# EAGLE design power_supply_board (EAGLE 7.2.0)
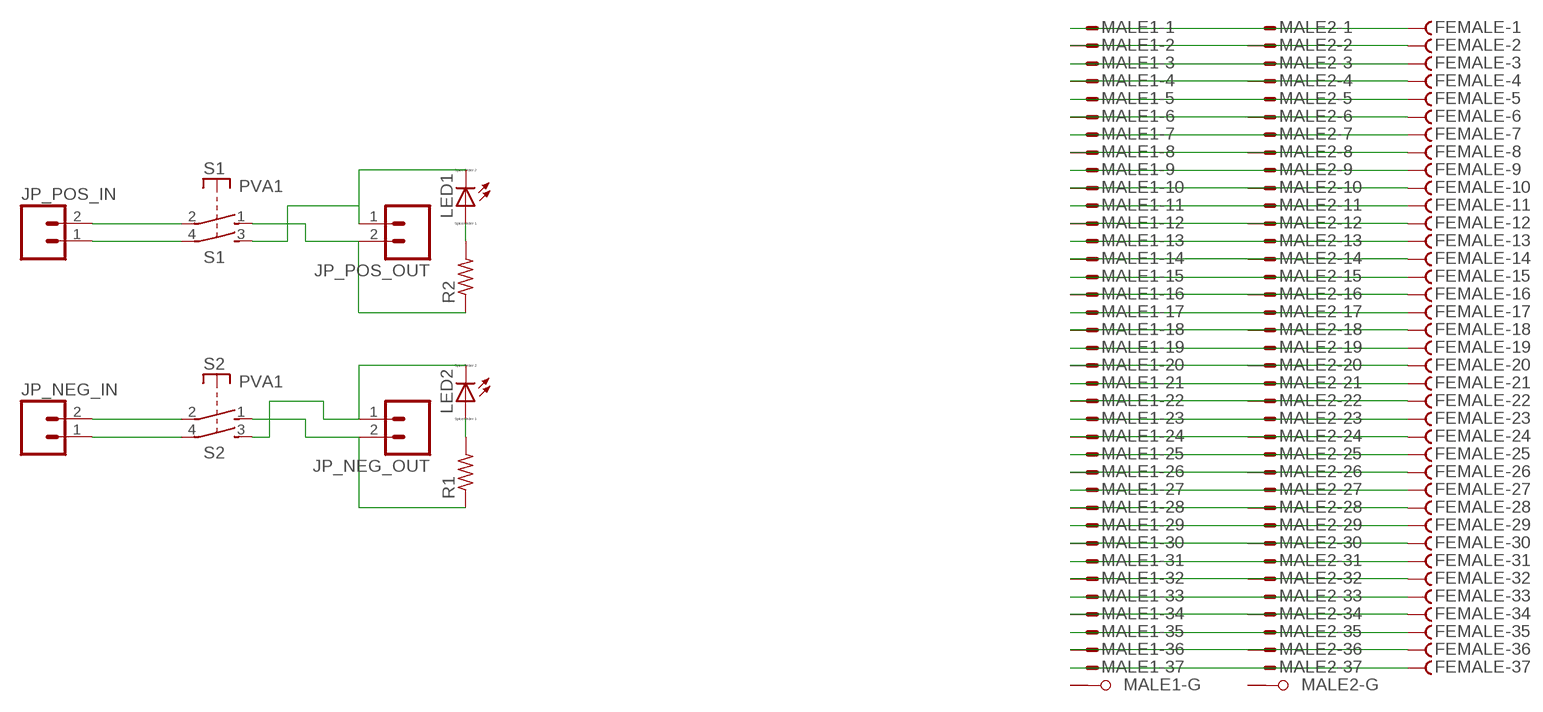
[diagram p0: schematic, sheet 1]

## Parts
FEMALE  F37HPS  [F37HP]
JP_NEG_IN  M02-JST-2MM-SMT  [JST-2-SMD]
JP_NEG_OUT  M02-JST-2MM-SMT  [JST-2-SMD]
JP_POS_IN  M02-JST-2MM-SMT  [JST-2-SMD]
JP_POS_OUT  M02-JST-2MM-SMT  [JST-2-SMD]
LED1  LED_ELED0402  [C0402]
LED2  LED_ELED0402  [C0402]
MALE1  M37HPS  [M37HP]
MALE2  M37HPS  [M37HP]
R1  R-US_R0805  [R0805]
R2  R-US_R0805  [R0805]
S1  PVA1  [PVA1F]
S2  PVA1  [PVA1F]

## Nets
N$1: LED1.A R2.2
N$2: LED2.A R1.2
N$3: JP_POS_IN.2 S1.2(1:P)
N$4: JP_POS_IN.1 S1.4(2:P)
N$5: JP_NEG_IN.2 S2.2(1:P)
N$6: JP_NEG_IN.1 S2.4(2:P)
N$7: JP_POS_OUT.2 R2.1 S1.1(1:S)
N$8: JP_POS_OUT.1 LED1.C S1.3(2:S)
N$9: JP_NEG_OUT.2 R1.1 S2.1(1:S)
N$10: JP_NEG_OUT.1 LED2.C S2.3(2:S)
N$11: FEMALE.1 MALE1.1(-1:M) MALE2.1(-1:M)
N$12: FEMALE.2 MALE1.2(-2:M) MALE2.2(-2:M)
N$13: FEMALE.3 MALE1.3(-3:M) MALE2.3(-3:M)
N$14: FEMALE.4 MALE1.4(-4:M) MALE2.4(-4:M)
N$15: FEMALE.5 MALE1.5(-5:M) MALE2.5(-5:M)
N$16: FEMALE.6 MALE1.6(-6:M) MALE2.6(-6:M)
N$17: FEMALE.7 MALE1.7(-7:M) MALE2.7(-7:M)
N$18: FEMALE.8 MALE1.8(-8:M) MALE2.8(-8:M)
N$19: FEMALE.9 MALE1.9(-9:M) MALE2.9(-9:M)
N$20: FEMALE.10 MALE1.10(-10:M) MALE2.10(-10:M)
N$21: FEMALE.11 MALE1.11(-11:M) MALE2.11(-11:M)
N$22: FEMALE.12 MALE1.12(-12:M) MALE2.12(-12:M)
N$23: FEMALE.13 MALE1.13(-13:M) MALE2.13(-13:M)
N$24: FEMALE.14 MALE1.14(-14:M) MALE2.14(-14:M)
N$25: FEMALE.15 MALE1.15(-15:M) MALE2.15(-15:M)
N$26: FEMALE.16 MALE1.16(-16:M) MALE2.16(-16:M)
N$27: FEMALE.17 MALE1.17(-17:M) MALE2.17(-17:M)
N$28: FEMALE.18 MALE1.18(-18:M) MALE2.18(-18:M)
N$29: FEMALE.19 MALE1.19(-19:M) MALE2.19(-19:M)
N$30: FEMALE.20 MALE1.20(-20:M) MALE2.20(-20:M)
N$31: FEMALE.21 MALE1.21(-21:M) MALE2.21(-21:M)
N$32: FEMALE.22 MALE1.22(-22:M) MALE2.22(-22:M)
N$33: FEMALE.23 MALE1.23(-23:M) MALE2.23(-23:M)
N$34: FEMALE.24 MALE1.24(-24:M) MALE2.24(-24:M)
N$35: FEMALE.25 MALE1.25(-25:M) MALE2.25(-25:M)
N$36: FEMALE.26 MALE1.26(-26:M) MALE2.26(-26:M)
N$37: FEMALE.27 MALE1.27(-27:M) MALE2.27(-27:M)
N$38: FEMALE.28 MALE1.28(-28:M) MALE2.28(-28:M)
N$39: FEMALE.29 MALE1.29(-29:M) MALE2.29(-29:M)
N$40: FEMALE.30 MALE1.30(-30:M) MALE2.30(-30:M)
N$41: FEMALE.31 MALE1.31(-31:M) MALE2.31(-31:M)
N$42: FEMALE.32 MALE1.32(-32:M) MALE2.32(-32:M)
N$43: FEMALE.33 MALE1.33(-33:M) MALE2.33(-33:M)
N$44: FEMALE.34 MALE1.34(-34:M) MALE2.34(-34:M)
N$45: FEMALE.35 MALE1.35(-35:M) MALE2.35(-35:M)
N$46: FEMALE.36 MALE1.36(-36:M) MALE2.36(-36:M)
N$47: FEMALE.37 MALE1.37(-37:M) MALE2.37(-37:M)
Unconnected: MALE1.G1(-G:G1) MALE1.G2(-G:G2) MALE2.G1(-G:G1) MALE2.G2(-G:G2)

## Library data of the parts
FEMALE = con-subd:F37?S: SUB-D; OC_FARNELL: unknown; OC_NEWARK: unknown
JP_NEG_IN JP_NEG_OUT JP_POS_IN JP_POS_OUT = SwitchBoard:M02: Header 2 Standard 2-pin 0.1" header. Use with straight break away headers (SKU : PRT-00116), right angle break away headers (PRT-00553), swiss pins (PRT-00743), machine pins (PRT-00117), and female headers (PRT-00115). Molex polarized connector foot print use with SKU : PRT-08233 with associated crimp pins and housings.
LED1 LED2 = eagle-ltspice:LED_E: LED Source: http://www.osram.convergy.de Source: www.luxeon.com Source: www.kingbright.com
MALE1 MALE2 = con-subd:M37HPS: SUB-D; OC_FARNELL: unknown; OC_NEWARK: unknown
R1 R2 = resistor:R-US_: RESISTOR, American symbol
S1 S2 = switch-misc:PVA1: ITT SWITCH

## Board
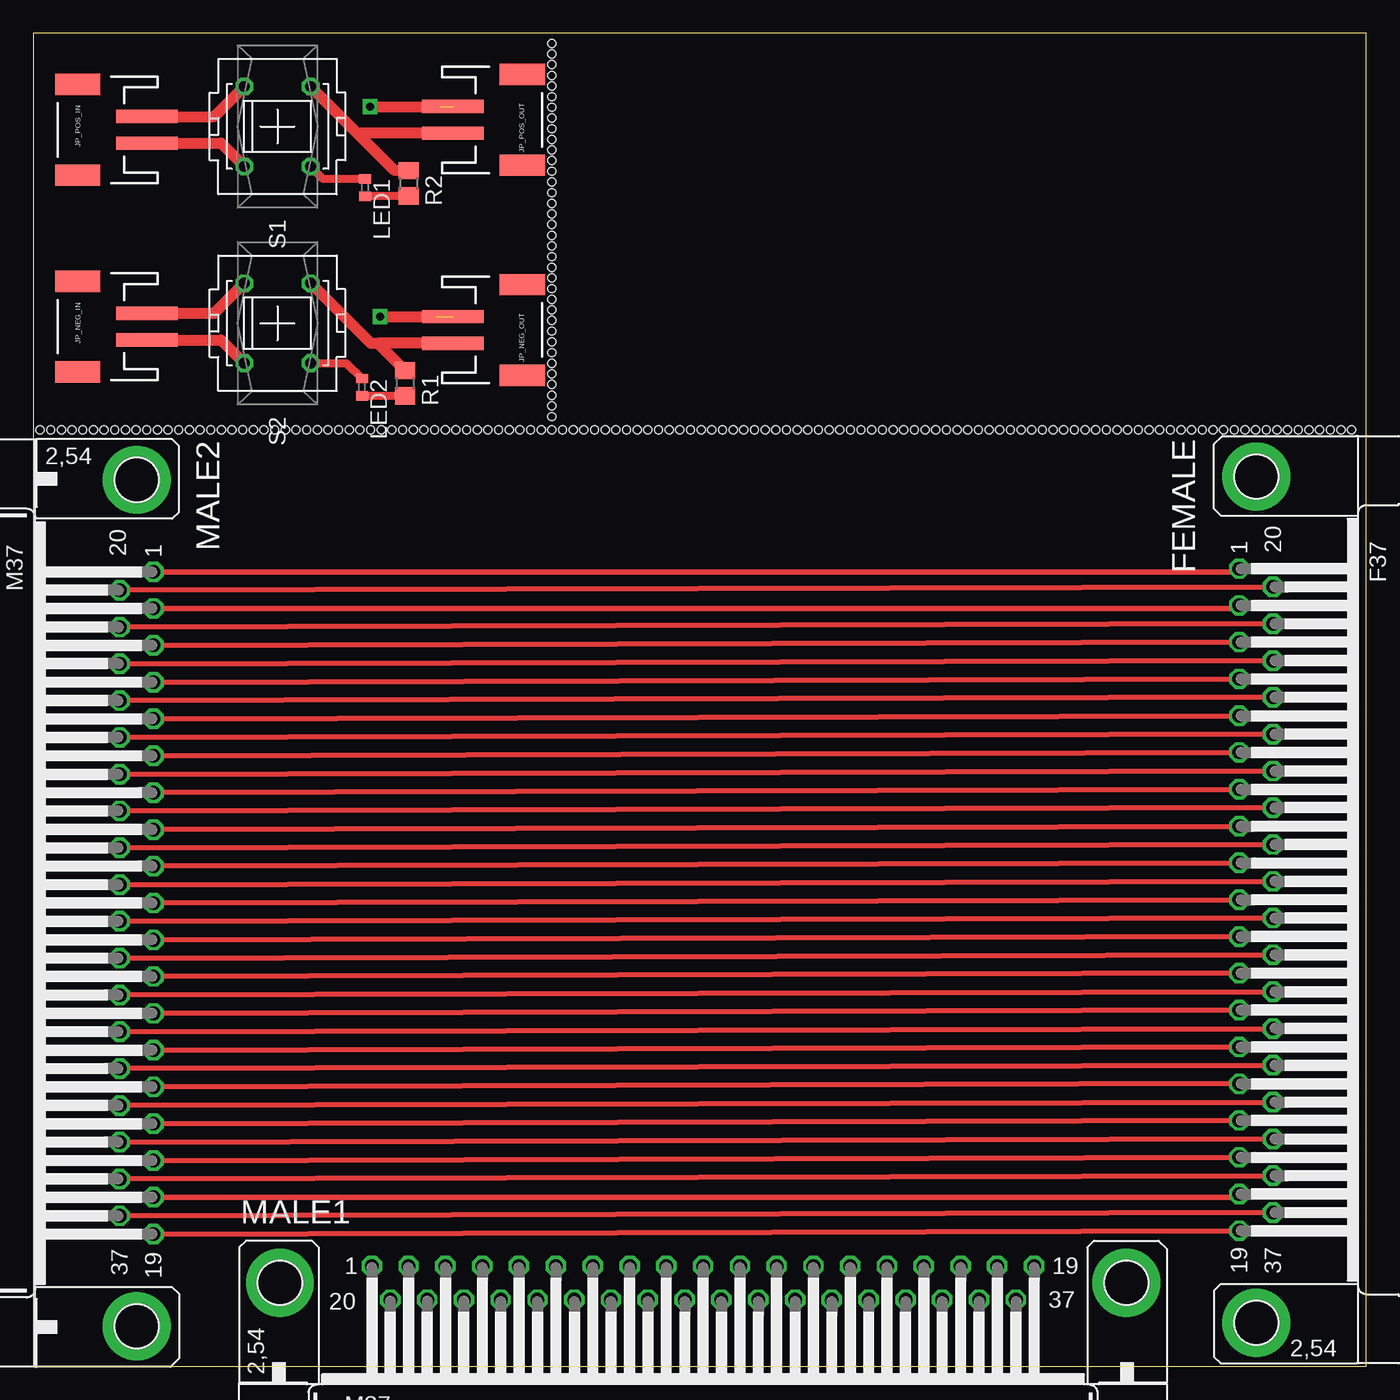
[diagram p1: board, top side]
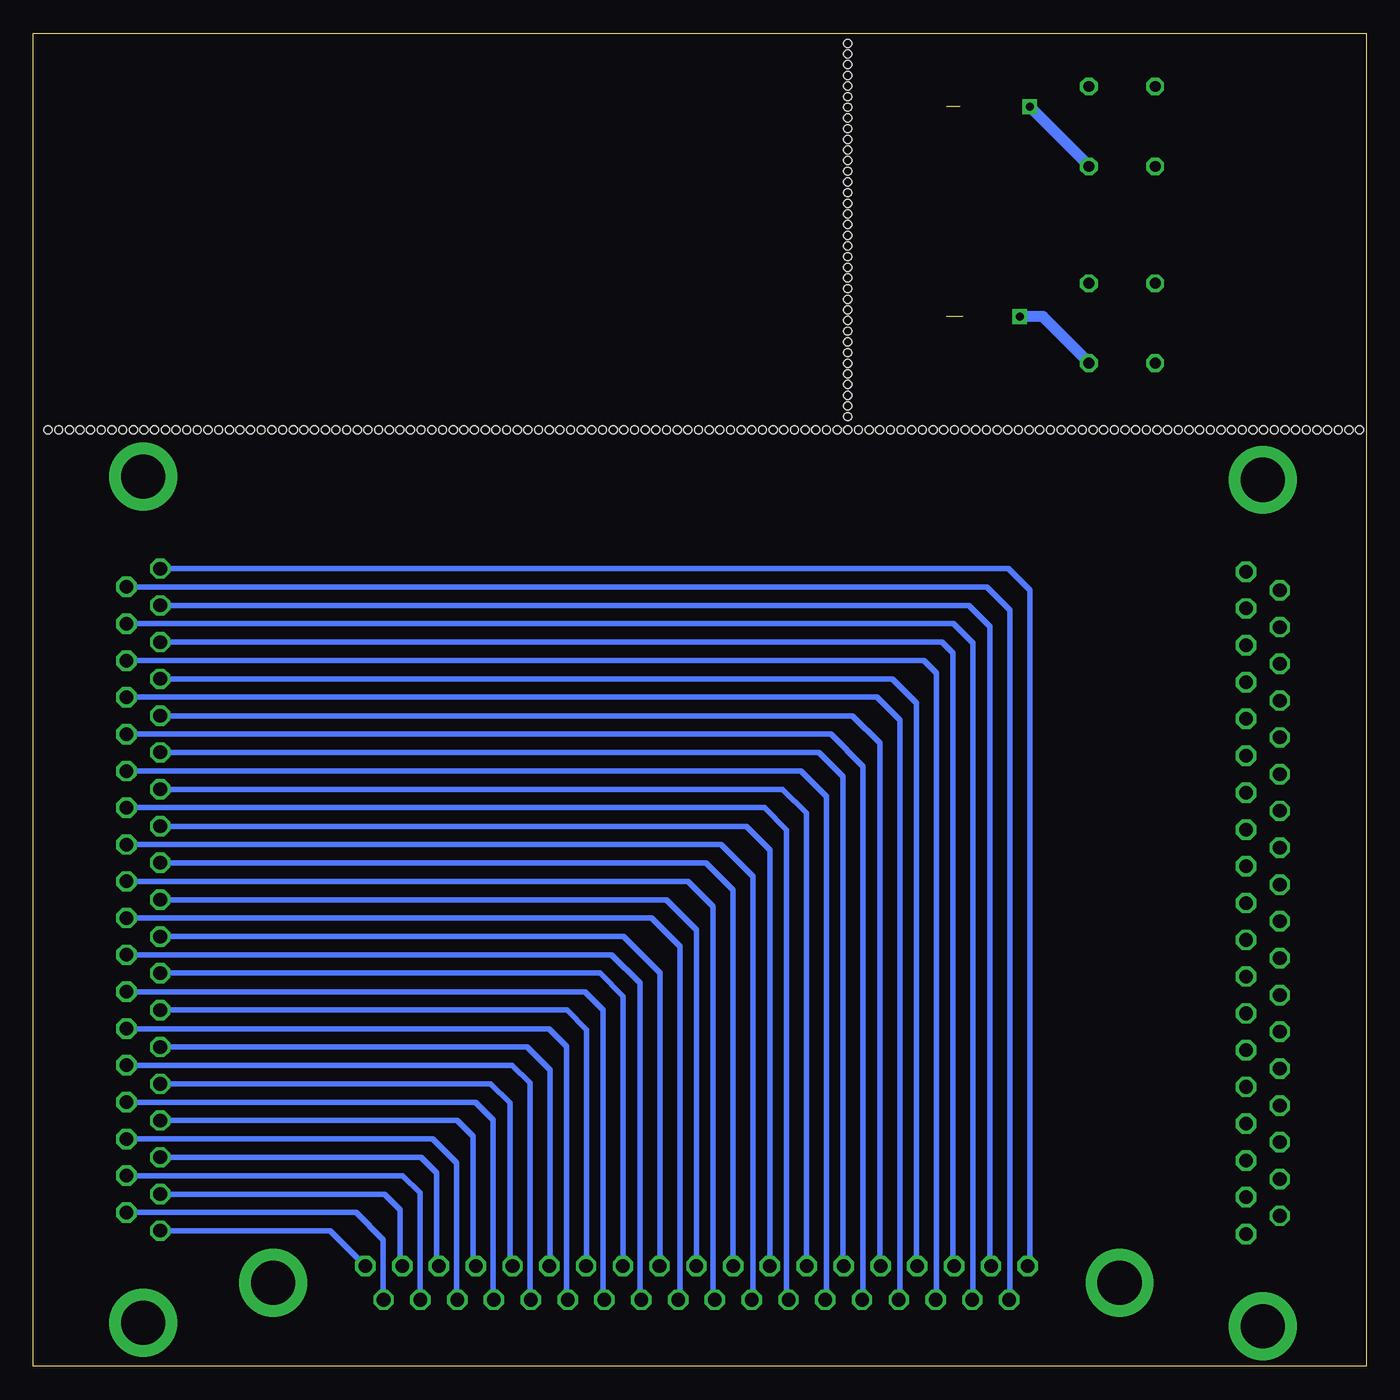
[diagram p2: board, bottom side, seen from below]

Size 100 x 100 mm. Coordinates in mm from the lower left corner, seen from the top.
Outline: 0,0 100,0 100,100 0,100 0,0
Copper layers (1*16): Top 0.035mm / dielectric 1.5mm / Bottom 0.035mm
Design rules "pcbtrain": minimum track width 0.2mm, minimum drill 0.4mm, track to track 0.2mm, track to pad 0.2mm, pad to pad 0.2mm, via to via 0.2mm, smd to smd 0mil, copper to edge 10mil, drill to drill 0.2mm, minimum pad ring 10mil, minimum via ring 10mil, stop-mask expansion 0.125mm, vias tented up to drill 0mil, thermal gap 10mil
Holes 0.6 mm at 0.5,70.25 1.3,70.25 2.1,70.25 2.9,70.25 3.7,70.25 4.5,70.25 5.3,70.25 6.1,70.25 6.9,70.25 7.7,70.25 8.5,70.25 9.3,70.25 10.1,70.25 10.9,70.25 11.7,70.25 12.5,70.25 13.3,70.25 14.1,70.25 14.9,70.25 15.7,70.25 16.5,70.25 17.3,70.25 18.1,70.25 18.9,70.25 19.7,70.25 20.5,70.25 21.3,70.25 22.1,70.25 22.9,70.25 23.7,70.25 24.5,70.25 25.3,70.25 26.1,70.25 26.9,70.25 27.7,70.25 28.5,70.25 29.3,70.25 30.1,70.25 30.9,70.25 31.7,70.25 32.5,70.25 33.3,70.25 34.1,70.25 34.9,70.25 35.7,70.25 36.5,70.25 37.3,70.25 38.1,70.25 38.9,70.25 39.7,70.25 40.5,70.25 41.3,70.25 42.1,70.25 42.9,70.25 43.7,70.25 44.5,70.25 45.3,70.25 46.1,70.25 46.9,70.25 47.7,70.25 48.5,70.25 49.3,70.25 50.1,70.25 50.9,70.25 51.7,70.25 52.5,70.25 53.3,70.25 54.1,70.25 54.9,70.25 55.7,70.25 56.5,70.25 57.3,70.25 58.1,70.25 58.9,70.25 59.7,70.25 60.5,70.25 61.3,70.25 62.1,70.25 62.9,70.25 63.7,70.25 64.5,70.25 65.3,70.25 66.1,70.25 66.9,70.25 67.7,70.25 68.5,70.25 69.3,70.25 70.1,70.25 70.9,70.25 71.7,70.25 72.5,70.25 73.3,70.25 74.1,70.25 74.9,70.25 75.7,70.25 76.5,70.25 77.3,70.25 78.1,70.25 78.9,70.25 79.7,70.25 80.5,70.25 81.3,70.25 82.1,70.25 82.9,70.25 83.7,70.25 84.5,70.25 85.3,70.25 86.1,70.25 86.9,70.25 87.7,70.25 88.5,70.25 89.3,70.25 90.1,70.25 90.9,70.25 91.7,70.25 92.5,70.25 93.3,70.25 94.1,70.25 94.9,70.25 95.7,70.25 96.5,70.25 97.3,70.25 98.1,70.25 98.9,70.25 38.9,71.25 38.9,72.05 38.9,72.85 38.9,73.65 38.9,74.45 38.9,75.25 38.9,76.05 38.9,76.85 38.9,77.65 38.9,78.45 38.9,79.25 38.9,80.05 38.9,80.85 38.9,81.65 38.9,82.45 38.9,83.25 38.9,84.05 38.9,84.85 38.9,85.65 38.9,86.45 38.9,87.25 38.9,88.05 38.9,88.85 38.9,89.65 38.9,90.45 38.9,91.25 38.9,92.05 38.9,92.85 38.9,93.65 38.9,94.45 38.9,95.25 38.9,96.05 38.9,96.85 38.9,97.65 38.9,98.45 38.9,99.25

### Footprints (pad centres in the part's own frame; a part is rotated, then mirrored left to right if it is on the bottom)
F37HP = drill 1.016 octagon: 1 -24.841,-1.27; 2 -22.073,-1.27; 3 -19.329,-1.27; 4 -16.561,-1.27; 5 -13.792,-1.27; 6 -11.049,-1.27; 7 -8.28,-1.27; 8 -5.512,-1.27; 9 -2.769,-1.27; 10 0,-1.27; 11 2.769,-1.27; 12 5.512,-1.27; 13 8.28,-1.27; 14 11.049,-1.27; 15 13.818,-1.27; 16 16.561,-1.27; 17 19.329,-1.27; 18 22.098,-1.27; 19 24.841,-1.27; 20 -23.47,1.27; 21 -20.701,1.27; 22 -17.932,1.27; 23 -15.189,1.27; 24 -12.421,1.27; 25 -9.652,1.27; 26 -6.909,1.27; 27 -4.14,1.27; 28 -1.372,1.27; 29 1.372,1.27; 30 4.14,1.27; 31 6.909,1.27; 32 9.677,1.27; 33 12.421,1.27; 34 15.189,1.27; 35 17.958,1.27; 36 20.701,1.27; 37 23.47,1.27 | drill 3.302 pad 5.08: G1 -31.75,0; G2 31.75,0
JST-2-SMD = smd 1 x 4.6: 1 -1,-3.7; 2 1,-3.7 | smd 1.6 x 3.4: NC1 -3.4,1.5; NC2 3.4,1.5
C0402 = smd 0.7 x 0.9: A 0.65,0; C -0.65,0
M37HP = drill 1.016 octagon: 1 -24.841,1.27; 2 -22.098,1.27; 3 -19.329,1.27; 4 -16.561,1.27; 5 -13.818,1.27; 6 -11.049,1.27; 7 -8.28,1.27; 8 -5.512,1.27; 9 -2.769,1.27; 10 0,1.27; 11 2.769,1.27; 12 5.512,1.27; 13 8.28,1.27; 14 11.049,1.27; 15 13.792,1.27; 16 16.561,1.27; 17 19.329,1.27; 18 22.073,1.27; 19 24.841,1.27; 20 -23.47,-1.27; 21 -20.701,-1.27; 22 -17.958,-1.27; 23 -15.189,-1.27; 24 -12.421,-1.27; 25 -9.652,-1.27; 26 -6.909,-1.27; 27 -4.14,-1.27; 28 -1.372,-1.27; 29 1.372,-1.27; 30 4.14,-1.27; 31 6.909,-1.27; 32 9.652,-1.27; 33 12.421,-1.27; 34 15.189,-1.27; 35 17.932,-1.27; 36 20.701,-1.27; 37 23.47,-1.27 | drill 3.302 pad 5.08: G1 -31.75,0; G2 31.75,0
R0805 = smd 1.3 x 1.5: 1 -0.95,0; 2 0.95,0
PVA1F = drill 0.813 octagon: 1 -2.997,2.489; 2 -2.997,-2.489; 3 2.997,2.489; 4 2.997,-2.489

### Placement (x,y rotation side)
FEMALE  91.75,35 270 top
JP_NEG_IN  4.83,78 90 top
JP_NEG_OUT  35.18,77.75 270 top
JP_POS_IN  4.83,92.76 90 top
JP_POS_OUT  35.18,93.51 270 top
LED1  24.88,88.42 270 top
LED2  24.65,73.44 270 top
MALE1  50.25,6.25 0 top
MALE2  7.75,34.75 270 top
R1  27.88,73.75 270 top
R2  28.15,88.75 270 top
S1  18.32,93.01 270 top
S2  18.32,78.25 270 top

### Tracks (layer width: path | path; a pad name or v marks a point on that pad's centre or on a via)
N$1
  Top 0.61: R2.2 28.12,87.77 LED1.A
N$2
  Top 0.61: R1.2 LED2.A
N$3
  Top 0.813: JP_POS_IN.2 13.58,93.76 S1.2
N$4
  Top 0.813: JP_POS_IN.1 14.08,91.76 S1.4
N$5
  Top 0.813: JP_NEG_IN.2 13.58,79 S2.2
N$6
  Top 0.813: JP_NEG_IN.1 14.08,77 S2.4
N$7
  Top 0.813: JP_POS_OUT.2 24.31,92.51 | 24.31,92.51 S1.1 | R2.1 27.12,89.7 24.31,92.51
N$8  (via drill 0.6)  (1 unrouted)
  Top 0.61: LED1.C 21.75,89.07 S1.3
  Top 0.813: v25.25,94.5 30.5,94.5
  Bottom 0.813: S1.3 20.81,90.06 v25.25,94.5
N$9
  Top 0.813: JP_NEG_OUT.2 25.83,76.75 | S2.1 25.31,76.75 25.83,76.75 | 25.83,76.75 R1.1
N$10  (via drill 0.6)  (1 unrouted)
  Top 0.61: S2.3 23.49,75.25 LED2.C
  Top 0.813: v26,78.75 30.25,78.75
  Bottom 0.813: S2.3 20.81,75.31 24.25,78.75 v26,78.75
N$11
  Top 0.406: MALE2.1 90.23,59.59 FEMALE.1
  Bottom 0.406: MALE1.1 25.25,7.68 25.25,58.25 26.84,59.84 FEMALE.1
N$12
  Top 0.406: MALE2.2 90.25,56.85 FEMALE.2
  Bottom 0.406: MALE1.2 28.25,7.62 28.25,55.5 29.82,57.07 FEMALE.2
N$13
  Top 0.406: MALE2.3 90.23,54.33 FEMALE.3
  Bottom 0.406: MALE1.3 31,7.6 31,53.5 31.83,54.33 FEMALE.3
N$14
  Top 0.406: FEMALE.4 MALE2.4
  Bottom 0.406: MALE1.4 33.75,7.58 33.75,49.75 35.56,51.56 FEMALE.4
N$15
  Top 0.406: FEMALE.5 9.24,48.54 MALE2.5
  Bottom 0.406: MALE1.5 36.5,7.59 36.5,46.75 38.54,48.79 FEMALE.5
N$16
  Top 0.406: FEMALE.6 9.27,45.8 MALE2.6
  Bottom 0.406: MALE1.6 39.25,7.57 39.25,44.25 41.05,46.05 FEMALE.6
N$17
  Top 0.406: FEMALE.7 MALE2.7
  Bottom 0.406: MALE1.7 42,7.55 42,41.5 43.78,43.28 FEMALE.7
N$18
  Top 0.406: FEMALE.8 MALE2.8
  Bottom 0.406: MALE1.8 44.75,7.53 44.75,38.75 46.51,40.51 FEMALE.8
N$19
  Top 0.406: FEMALE.9 9.27,37.52 MALE2.9
  Bottom 0.406: MALE1.9 47.5,7.54 47.5,35.75 49.52,37.77 FEMALE.9
N$20
  Top 0.406: FEMALE.10 9.27,34.75 MALE2.10
  Bottom 0.406: MALE1.10 50.25,32.75 52.5,35 FEMALE.10
N$21
  Top 0.406: FEMALE.11 9.27,31.98 MALE2.11
  Bottom 0.406: MALE1.11 53,7.54 53,29.5 55.73,32.23 FEMALE.11
N$22
  Top 0.406: MALE2.12 90.23,29.49 FEMALE.12
  Bottom 0.406: MALE1.12 55.75,7.53 55.75,27.75 57.49,29.49 FEMALE.12
N$23
  Top 0.406: MALE2.13 90.23,26.72 FEMALE.13
  Bottom 0.406: MALE1.13 58.5,7.55 58.5,25.25 59.97,26.72 FEMALE.13
N$24
  Top 0.406: MALE2.14 90.23,23.95 FEMALE.14
  Bottom 0.406: MALE1.14 61.25,7.57 61.25,22.25 62.95,23.95 FEMALE.14
N$25
  Top 0.406: MALE2.15 89.96,21.21 90.5,21.25 90.5,20.95 FEMALE.15
  Bottom 0.406: MALE1.15 64.25,7.73 64.25,19.75 65.68,21.18 FEMALE.15
N$26
  Top 0.406: MALE2.16 90.23,18.44 FEMALE.16
  Bottom 0.406: MALE1.16 67,7.71 67,17.25 68.19,18.44 FEMALE.16
N$27
  Top 0.406: MALE2.17 FEMALE.17
  Bottom 0.406: MALE1.17 69.75,7.69 69.75,14.5 70.92,15.67 FEMALE.17
N$28
  Top 0.406: MALE2.18 90.25,12.68 FEMALE.18
  Bottom 0.406: MALE1.18 72.5,7.7 72.5,11.75 73.65,12.9 FEMALE.18
N$29
  Top 0.406: MALE2.19 90.23,10.16 FEMALE.19
  Bottom 0.406: MALE1.19 77.73,10.16 FEMALE.19
N$30
  Top 0.406: FEMALE.20 6.73,58.22 MALE2.20
  Bottom 0.406: MALE1.20 26.75,5.01 26.75,56.75 28.47,58.47 FEMALE.20
N$31
  Top 0.406: FEMALE.21 6.73,55.45 MALE2.21
  Bottom 0.406: MALE1.21 29.5,5.03 29.5,54.25 30.95,55.7 FEMALE.21
N$32
  Top 0.406: FEMALE.22 6.71,52.68 MALE2.22
  Bottom 0.406: MALE1.22 32.25,5.02 32.25,52 33.18,52.93 FEMALE.22
N$33
  Top 0.406: FEMALE.23 6.44,49.94 6,49.75 6.29,49.75 MALE2.23
  Bottom 0.406: MALE1.23 35,5.04 35,48.5 36.69,50.19 FEMALE.23
N$34
  Top 0.406: FEMALE.24 6.73,47.17 MALE2.24
  Bottom 0.406: MALE1.24 37.75,5.06 37.75,45 40.17,47.42 FEMALE.24
N$35
  Top 0.406: FEMALE.25 6.73,44.4 MALE2.25
  Bottom 0.406: MALE1.25 40.5,5.08 40.5,42.75 42.4,44.65 92.5,44.65 FEMALE.25
N$36
  Top 0.406: FEMALE.26 6.73,41.66 MALE2.26
  Bottom 0.406: MALE1.26 43.5,5.14 43.5,40.25 45.16,41.91 FEMALE.26
N$37
  Top 0.406: FEMALE.27 6.73,38.89 MALE2.27
  Bottom 0.406: MALE1.27 46,5.09 46,36.75 48.39,39.14 FEMALE.27
N$38
  Top 0.406: FEMALE.28 6.73,36.12 MALE2.28
  Bottom 0.406: MALE1.28 49,5.1 49,34.5 50.87,36.37 FEMALE.28
N$39
  Top 0.406: FEMALE.29 6.73,33.38 MALE2.29
  Bottom 0.406: MALE1.29 51.5,5.1 51.5,31.5 53.63,33.63 FEMALE.29
N$40
  Top 0.406: MALE2.30 92.77,30.86 FEMALE.30
  Bottom 0.406: MALE1.30 54.5,5.09 54.5,28.75 56.61,30.86 FEMALE.30
N$41
  Top 0.406: FEMALE.31 6.73,27.84 MALE2.31
  Bottom 0.406: MALE1.31 57.25,5.07 57.25,26.75 58.59,28.09 FEMALE.31
N$42
  Top 0.406: FEMALE.32 6.71,25.07 MALE2.32
  Bottom 0.406: MALE1.32 60,5.08 60,24 61.32,25.32 FEMALE.32
N$43
  Top 0.406: FEMALE.33 6.73,22.33 MALE2.33
  Bottom 0.406: MALE1.33 62.75,5.06 62.75,21.25 64.08,22.58 FEMALE.33
N$44
  Top 0.406: FEMALE.34 6.73,19.56 MALE2.34
  Bottom 0.406: MALE1.34 65.5,5.04 65.5,18.5 66.81,19.81 FEMALE.34
N$45
  Top 0.406: FEMALE.35 6.96,16.79 MALE2.35
  Bottom 0.406: MALE1.35 68.25,5.05 68.25,15.25 70.04,17.04 FEMALE.35
N$46
  Top 0.406: FEMALE.36 6.73,14.05 MALE2.36
  Bottom 0.406: MALE1.36 71,5.03 71,13 72.3,14.3 FEMALE.36
N$47
  Top 0.406: FEMALE.37 6.73,11.28 MALE2.37
  Bottom 0.406: MALE1.37 73.75,5.01 73.75,9.5 75.78,11.53 92.5,11.53 FEMALE.37